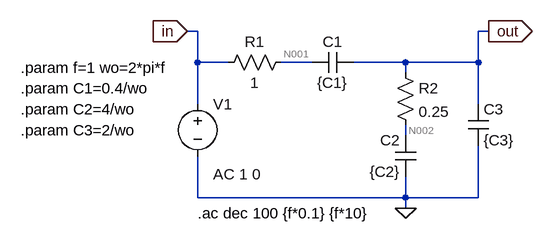
[diagram p0: schematic EJ2_Z.asc]
EJ2_Z.asc, the LTspice schematic file:
Version 4
SHEET 1 880 680
WIRE -48 32 -64 32
WIRE 400 32 384 32
WIRE -48 80 -48 32
WIRE 0 80 -48 80
WIRE 128 80 80 80
WIRE 272 80 192 80
WIRE 384 80 384 32
WIRE 384 80 272 80
WIRE 272 96 272 80
WIRE -48 144 -48 80
WIRE 384 144 384 80
WIRE 272 192 272 176
WIRE -48 288 -48 224
WIRE 272 288 272 256
WIRE 272 288 -48 288
WIRE 384 288 384 208
WIRE 384 288 272 288
WIRE 272 304 272 288
FLAG 272 304 0
FLAG -64 32 in
IOPIN -64 32 In
FLAG 400 32 out
IOPIN 400 32 Out
SYMBOL res 96 64 R90
WINDOW 0 0 56 VBottom 2
WINDOW 3 32 56 VTop 2
SYMATTR InstName R1
SYMATTR Value 1
SYMBOL cap 192 64 R90
WINDOW 0 0 32 VBottom 2
WINDOW 3 32 32 VTop 2
SYMATTR InstName C1
SYMATTR Value {C1}
SYMBOL cap 288 256 R180
WINDOW 0 24 56 Left 2
WINDOW 3 24 8 Left 2
SYMATTR InstName C2
SYMATTR Value {C2}
SYMBOL res 256 80 R0
SYMATTR InstName R2
SYMATTR Value 0.25
SYMBOL cap 368 144 R0
SYMATTR InstName C3
SYMATTR Value {C3}
SYMBOL voltage -48 128 R0
WINDOW 123 24 124 Left 2
WINDOW 39 0 0 Left 0
SYMATTR InstName V1
SYMATTR Value ""
SYMATTR Value2 AC 1 0
TEXT -320 88 Left 2 !.param f=1 wo=2*pi*f
TEXT -320 120 Left 2 !.param C1=0.4/wo
TEXT -320 152 Left 2 !.param C2=4/wo
TEXT -320 184 Left 2 !.param C3=2/wo
TEXT -48 312 Left 2 !.ac dec 100 {f*0.1} {f*10}

The netlist it stands for:
* EJ2_Z.asc
R1 N001 in 1
C1 out N001 {C1}
C2 0 N002 {C2}
R2 out N002 0.25
C3 out 0 {C3}
V1 in 0 AC 1 0
.param f=1 wo=2*pi*f
.param C1=0.4/wo
.param C2=4/wo
.param C3=2/wo
.ac dec 100 {f*0.1} {f*10}
.backanno
.end

* Results of the author's LTspice run, read from the files saved beside the schematic
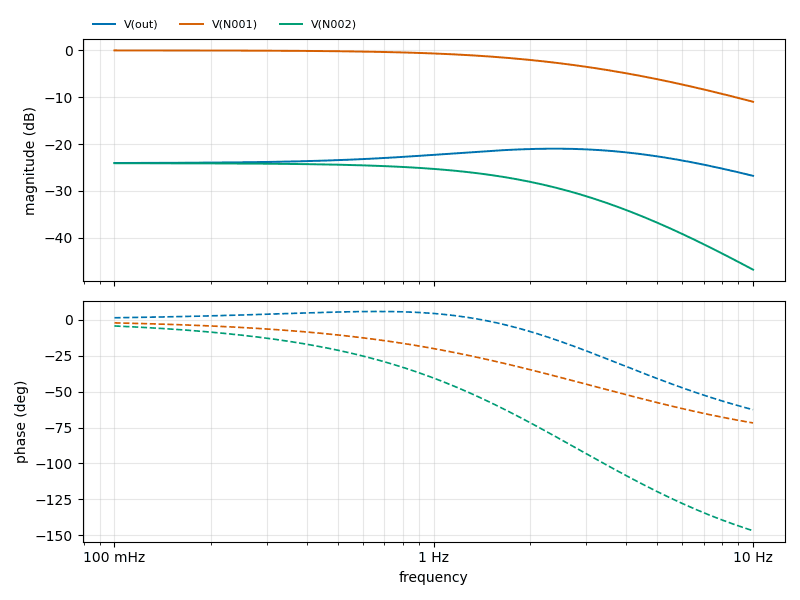
[diagram p1: AC Analysis of EJ2_Z.asc, plotted from the saved traces]
* AC Analysis, 1 run:
*   V(out): -24.05 dB at 100 mHz, -26.79 dB at 10 Hz, peak -20.99 dB at 2.399 Hz, 3 dB below the peak at 165.1 mHz and 6.542 Hz
*   V(N001): -0.01 dB at 100 mHz, -10.97 dB at 10 Hz, peak -0.01 dB at 100 mHz, 3 dB below the peak at 2.662 Hz
*   V(N002): -24.10 dB at 100 mHz, -46.84 dB at 10 Hz, peak -24.10 dB at 100 mHz, 3 dB below the peak at 1.68 Hz